# Altium project UZ_CarrierBoard.PrjPcb (part 4 of 10)

## Sheet J2-1xGTHQ_L+1xGTHCLK+GTRQ+2xGTRCLK+4xPLLCLK+CFG+STAT.SchDoc
size A4; PageSetup: Record=PageOptions|CenterHorizontal=True|CenterVertical=True|PrintScale=1.00|XCorrection=1.00|YCorrection=1.00|PrintKind=0|BorderSize=5000000|LeftOffset=0|BottomOffset=0|Orientation=2|PaperLength=1000|PaperWidth=1000|Scale=100|PaperSource=7|PrintQuality=-3|MediaType=1|DitherType=10|PrintScaleMode=1|PaperKind=A4|PaperIndex=9; Author: AG / EA / MG; CompanyName: Technische Hochschule Nürnberg Georg Simon Ohm; Address1: Kesslerplatz 12; Address2: 90489 Nürnberg; Address3: GERMANY; SheetNumber: 4; Website: www.ultrazohm.com
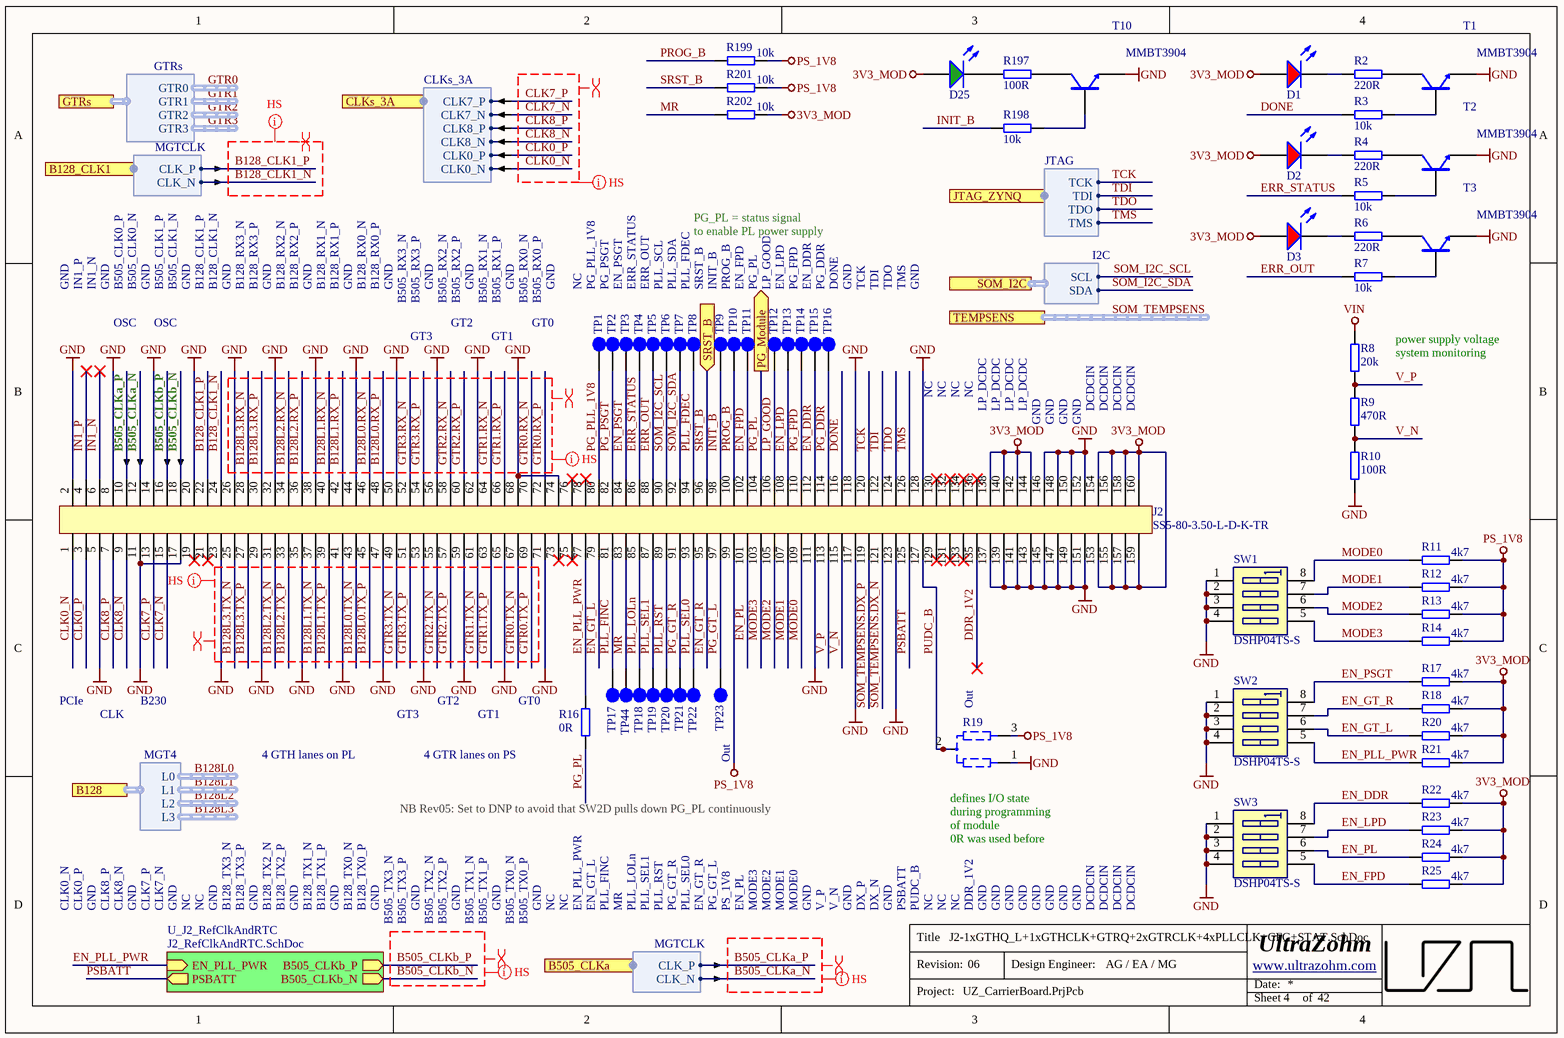
[diagram p11: J2-1xGTHQ_L+1xGTHCLK+GTRQ+2xGTRCLK+4xPLLCLK+CFG+STAT.SchDoc]

### Parts
D1  LED Red  [WL-SMCW_0603]  (value not drawn)
D2  LED Red  [WL-SMCW_0603]  (value not drawn)
D3  LED Red  [WL-SMCW_0603]  (value not drawn)
D25  LED Green  [WL-SMCW_0603]  (value not drawn)
J2  SS5-80-3.50-L-D-K-TR  [SS5-80-3.50-L-D-K-TR]
R2  220R  [R_0603_TE]
R3  10k  [R_0603_TE]
R4  220R  [R_0603_TE]
R5  10k  [R_0603_TE]
R6  220R  [R_0603_TE]
R7  10k  [R_0603_TE]
R8  20k  [R_0603_TE]
R9  470R  [R_0603_TE]
R10  100R  [R_0603_TE]
R11  4k7  [R_0603_TE]
R12  4k7  [R_0603_TE]
R13  4k7  [R_0603_TE]
R14  4k7  [R_0603_TE]
R16  0R  [R_0603_TE]
R17  4k7  [R_0603_TE]
R18  4k7  [R_0603_TE]
R19  Manual Assembly 1608 (0603)  [TP_DUAL_RES_0603]  (value not drawn)  (no BOM)
R20  4k7  [R_0603_TE]
R21  4k7  [R_0603_TE]
R22  4k7  [R_0603_TE]
R23  4k7  [R_0603_TE]
R24  4k7  [R_0603_TE]
R25  4k7  [R_0603_TE]
R197  100R  [R_0603_TE]
R198  10k  [R_0603_TE]
R199  10k  [R_0603_TE]
R201  10k  [R_0603_TE]
R202  10k  [R_0603_TE]
SW1  DSHP04TS-S  [416131160804]
SW2  DSHP04TS-S  [416131160804]
SW3  DSHP04TS-S  [416131160804]
T1  MMBT3904  [SOT95P280X145-3N]
T2  MMBT3904  [SOT95P280X145-3N]
T3  MMBT3904  [SOT95P280X145-3N]
T10  MMBT3904  [SOT95P280X145-3N]
TP1  Testpoint 1mm  [TP_1mm]  (value not drawn)  (no BOM)
TP2  Testpoint 1mm  [TP_1mm]  (value not drawn)  (no BOM)
TP3  Testpoint 1mm  [TP_1mm]  (value not drawn)  (no BOM)
TP4  Testpoint 1mm  [TP_1mm]  (value not drawn)  (no BOM)
TP5  Testpoint 1mm  [TP_1mm]  (value not drawn)  (no BOM)
TP6  Testpoint 1mm  [TP_1mm]  (value not drawn)  (no BOM)
TP7  Testpoint 1mm  [TP_1mm]  (value not drawn)  (no BOM)
TP8  Testpoint 1mm  [TP_1mm]  (value not drawn)  (no BOM)
TP9  Testpoint 1mm  [TP_1mm]  (value not drawn)  (no BOM)
TP10  Testpoint 1mm  [TP_1mm]  (value not drawn)  (no BOM)
TP11  Testpoint 1mm  [TP_1mm]  (value not drawn)  (no BOM)
TP12  Testpoint 1mm  [TP_1mm]  (value not drawn)  (no BOM)
TP13  Testpoint 1mm  [TP_1mm]  (value not drawn)  (no BOM)
TP14  Testpoint 1mm  [TP_1mm]  (value not drawn)  (no BOM)
TP15  Testpoint 1mm  [TP_1mm]  (value not drawn)  (no BOM)
TP16  Testpoint 1mm  [TP_1mm]  (value not drawn)  (no BOM)
TP17  Testpoint 1mm  [TP_1mm]  (value not drawn)  (no BOM)
TP18  Testpoint 1mm  [TP_1mm]  (value not drawn)  (no BOM)
TP19  Testpoint 1mm  [TP_1mm]  (value not drawn)  (no BOM)
TP20  Testpoint 1mm  [TP_1mm]  (value not drawn)  (no BOM)
TP21  Testpoint 1mm  [TP_1mm]  (value not drawn)  (no BOM)
TP22  Testpoint 1mm  [TP_1mm]  (value not drawn)  (no BOM)
TP23  Testpoint 1mm  [TP_1mm]  (value not drawn)  (no BOM)
TP44  Testpoint 1mm  [TP_1mm]  (value not drawn)  (no BOM)

### Sub-sheets
U_J2_RefClkAndRTC = J2_RefClkAndRTC.SchDoc: EN_PLL_PWR (in), B505_CLKb_P (out), B505_CLKb_N (out), PSBATT (out)

### Ports
B128 (harness MGT4), B128_CLK1 (harness MGTCLK), B505_CLKa (harness MGTCLK), CLKs_3A (harness CLKs_3A), GTRs (harness GTRs), JTAG_ZYNQ (harness JTAG), PG_Module (out), SOM_I2C (harness I2C), SRST_B (in), TEMPSENS (harness T_DIODE)

### Harnesses
JTAG: TDI, TCK, TMS, TDO
I2C: SCL, SDA
GTRs: GTR0, GTR1, GTR2, GTR3
MGTCLK: CLK_N, CLK_P
MGT4: L0, L1, L2, L3
CLKs_3A: CLK7_P, CLK7_N, CLK8_P, CLK8_N, CLK0_N, CLK0_P

### Nets
3V3_MOD: D1.2(A) D2.2(A) D3.2(A) D25.2(A) J2.138 J2.140 J2.142 J2.144 J2.153 J2.154 J2.155 J2.156 J2.157 J2.158 J2.159 J2.160 R17.2 R18.2 R20.2 R21.2 R22.2 R23.2 R24.2 R25.2 R202.2
GND: J2.2 J2.5 J2.8 J2.11 J2.14 J2.17 J2.20 J2.23 J2.26 J2.29 J2.32 J2.35 J2.38 J2.41 J2.44 J2.47 J2.50 J2.53 J2.56 J2.59 J2.62 J2.65 J2.68 J2.71 J2.74 J2.111 J2.117 J2.118 J2.123 J2.128 J2.137 J2.139 J2.141 J2.143 J2.145 J2.146 J2.147 J2.148 J2.149 J2.150 J2.151 J2.152 R10.1 R19.1 SW1.1 SW1.2 SW1.3 SW1.4 SW2.1 SW2.2 SW2.3 SW2.4 SW3.1 SW3.2 SW3.3 SW3.4 T1.2(EMITTER) T2.2(EMITTER) T3.2(EMITTER) T10.2(EMITTER)
PS_1V8: J2.99 R11.2 R12.2 R13.2 R14.2 R19.3 R199.2 R201.2
VIN: R8.2
B128_CLK1_N: J2.24 ; port B128_CLK1.CLK_N
B128_CLK1_P: J2.22 ; port B128_CLK1.CLK_P
B128L0.RX_N: J2.46
B128L0.RX_P: J2.48
B128L0.TX_N: J2.43
B128L0.TX_P: J2.45
B128L1.RX_N: J2.40
B128L1.RX_P: J2.42
B128L1.TX_N: J2.37
B128L1.TX_P: J2.39
B128L2.RX_N: J2.34
B128L2.RX_P: J2.36
B128L2.TX_N: J2.31
B128L2.TX_P: J2.33
B128L3.RX_N: J2.28
B128L3.RX_P: J2.30
B128L3.TX_N: J2.25
B128L3.TX_P: J2.27
B505_CLKa_N: J2.12 ; port B505_CLKa.CLK_N
B505_CLKa_P: J2.10 ; port B505_CLKa.CLK_P
B505_CLKb_N: J2.18 ; sheet U_J2_RefClkAndRTC/B505_CLKb_N
B505_CLKb_P: J2.16 ; sheet U_J2_RefClkAndRTC/B505_CLKb_P
CLK0_N: J2.1 ; port CLKs_3A.CLK0_N
CLK0_P: J2.3 ; port CLKs_3A.CLK0_P
CLK7_N: J2.15 ; port CLKs_3A.CLK7_N
CLK7_P: J2.13 ; port CLKs_3A.CLK7_P
CLK8_N: J2.9 ; port CLKs_3A.CLK8_N
CLK8_P: J2.7 ; port CLKs_3A.CLK8_P
DDR_1V2: J2.135
DONE: J2.116 R3.1
EN_DDR: J2.112 R22.1 SW3.8 TP15.1
EN_FPD: J2.102 R25.1 SW3.5 TP11.1
EN_GT_L: J2.79 R20.1 SW2.6
EN_GT_R: J2.95 R18.1 SW2.7
EN_LPD: J2.108 R23.1 SW3.7 TP13.1
EN_PL: J2.101 R24.1 SW3.6
EN_PLL_PWR: J2.77 R16.2 R21.1 SW2.5 ; sheet U_J2_RefClkAndRTC/EN_PLL_PWR
EN_PSGT: J2.84 R17.1 SW2.8 TP3.1
ERR_OUT: J2.88 R7.1 TP5.1
ERR_STATUS: J2.86 R5.1 TP4.1
GTR0.RX_N: J2.70
GTR0.RX_P: J2.72
GTR0.TX_N: J2.67
GTR0.TX_P: J2.69
GTR1.RX_N: J2.64
GTR1.RX_P: J2.66
GTR1.TX_N: J2.61
GTR1.TX_P: J2.63
GTR2.RX_N: J2.58
GTR2.RX_P: J2.60
GTR2.TX_N: J2.55
GTR2.TX_P: J2.57
GTR3.RX_N: J2.52
GTR3.RX_P: J2.54
GTR3.TX_N: J2.49
GTR3.TX_P: J2.51
IN1_N: J2.6
IN1_P: J2.4
INIT_B: J2.98 R198.1 TP9.1
LP_GOOD: J2.106 TP12.1
MODE0: J2.109 R11.1 SW1.8
MODE1: J2.107 R12.1 SW1.7
MODE2: J2.105 R13.1 SW1.6
MODE3: J2.103 R14.1 SW1.5
MR: J2.83 R202.1 TP44.1
PG_DDR: J2.114 TP16.1
PG_FPD: J2.110 TP14.1
PG_GT_L: J2.97 TP23.1
PG_GT_R: J2.91 TP21.1
PG_PL: J2.104 R16.1 ; port PG_Module  [project net PG_Module]
PG_PLL_1V8: J2.80 TP1.1
PG_PSGT: J2.82 TP2.1
PLL_FDEC: J2.94 TP8.1
PLL_FINC: J2.81 TP17.1
PLL_LOLn: J2.85 TP18.1
PLL_RST: J2.89 TP20.1
PLL_SEL0: J2.93 TP22.1
PLL_SEL1: J2.87 TP19.1
PROG_B: J2.100 R199.1 TP10.1
PSBATT: J2.125 ; sheet U_J2_RefClkAndRTC/PSBATT
PUDC_B: J2.127 R19.2
SOM_I2C_SCL: J2.90 TP6.1 ; port SOM_I2C.SCL  [project net PS_I2C1_SCL]
SOM_I2C_SDA: J2.92 TP7.1 ; port SOM_I2C.SDA  [project net PS_I2C1_SDA]
SOM_TEMPSENS.DX_N: J2.121
SOM_TEMPSENS.DX_P: J2.119
SRST_B: J2.96 R201.1 ; port SRST_B
TCK: J2.120 ; port JTAG_ZYNQ.TCK
TDI: J2.122 ; port JTAG_ZYNQ.TDI
TDO: J2.124 ; port JTAG_ZYNQ.TDO
TMS: J2.126 ; port JTAG_ZYNQ.TMS
V_N: J2.115 R9.1 R10.2
V_P: J2.113 R8.1 R9.2
NetD1_1: D1.1(K) R2.1
NetD2_1: D2.1(K) R4.1
NetD3_1: D3.1(K) R6.1
NetD25_1: D25.1(K) R197.2
NetR2_2: R2.2 T1.3(COLLECTOR)
NetR3_2: R3.2 T1.1(BASIS)
NetR4_2: R4.2 T2.3(COLLECTOR)
NetR5_2: R5.2 T2.1(BASIS)
NetR6_2: R6.2 T3.3(COLLECTOR)
NetR7_2: R7.2 T3.1(BASIS)
NetR197_1: R197.1 T10.3(COLLECTOR)
NetR198_2: R198.2 T10.1(BASIS)

Not connected (* = marked no-connect by the designer): J2 19* 21* 73* 75* 76* 78* 129* 130* 131* 132* 133* 134* 136*

### Buses and harness runs
harness SOM_TEMPSENS = port TEMPSENS

### Layout directives
differential pair: B128_CLK1_N, B128_CLK1_P, B128L0.RX_N, B128L0.RX_P, B128L0.TX_N, B128L0.TX_P, B128L1.RX_N, B128L1.RX_P, B128L1.TX_N, B128L1.TX_P, B128L2.RX_N, B128L2.RX_P, B128L2.TX_N, B128L2.TX_P, B128L3.RX_N, B128L3.RX_P, B128L3.TX_N, B128L3.TX_P, B505_CLKa_N, B505_CLKa_P, B505_CLKb_N, B505_CLKb_P, CLK0_N, CLK0_P, CLK7_N, CLK7_P, CLK8_N, CLK8_P, GTR0.RX_N, GTR0.RX_P, GTR0.TX_N, GTR0.TX_P, GTR1.RX_N, GTR1.RX_P, GTR1.TX_N, GTR1.TX_P, GTR2.RX_N, GTR2.RX_P, GTR2.TX_N, GTR2.TX_P, GTR3.RX_N, GTR3.RX_P, GTR3.TX_N, GTR3.TX_P
net class HS: B128_CLK1_N, B128_CLK1_P, B128L0.RX_N, B128L0.RX_P, B128L0.TX_N, B128L0.TX_P, B128L1.RX_N, B128L1.RX_P, B128L1.TX_N, B128L1.TX_P, B128L2.RX_N, B128L2.RX_P, B128L2.TX_N, B128L2.TX_P, B128L3.RX_N, B128L3.RX_P, B128L3.TX_N, B128L3.TX_P, B505_CLKa_N, B505_CLKa_P, B505_CLKb_N, B505_CLKb_P, CLK0_N, CLK0_P, CLK7_N, CLK7_P, CLK8_N, CLK8_P, GTR0.RX_N, GTR0.RX_P, GTR0.TX_N, GTR0.TX_P, GTR1.RX_N, GTR1.RX_P, GTR1.TX_N, GTR1.TX_P, GTR2.RX_N, GTR2.RX_P, GTR2.TX_N, GTR2.TX_P, GTR3.RX_N, GTR3.RX_P, GTR3.TX_N, GTR3.TX_P

### Notes on the sheet
- PG_PL = status signal
  to enable PL power supply
- GND
- IN1_P
- IN1_N
- B505_CLK0_P
- B505_CLK0_N
- B505_CLK1_P
- B505_CLK1_N
- B128_CLK1_P
- B128_CLK1_N
- B128_RX3_N
- B128_RX3_P
- B128_RX2_N
- B128_RX2_P
- B128_RX1_N
- B128_RX1_P
- B128_RX0_N
- B128_RX0_P
- B505_RX3_N
- B505_RX3_P
- B505_RX2_N
- B505_RX2_P
- B505_RX1_N
- B505_RX1_P
- B505_RX0_N
- B505_RX0_P
- NC
- PG_PLL_1V8
- PG_PSGT
- EN_PSGT
- ERR_STATUS
- ERR_OUT
- PLL_SCL
- PLL_SDA
- PLL_FDEC
- SRST_B
- INIT_B
- PROG_B
- EN_FPD
- PG_PL
- LP_GOOD
- EN_LPD
- PG_FPD
- EN_DDR
- PG_DDR
- DONE
- TCK
- TDI
- TDO
- TMS
- OSC
- GT3
- GT2
- GT1
- GT0
- power supply voltage system monitoring
- LP_DCDC
- DCDCIN
- PCIe
- CLK
- B230
- (near R19) Out
- 4 GTH lanes on PL
- 4 GTR lanes on PS
- Out
- NB Rev05: Set to DNP to avoid that SW2D pulls down PG_PL continuously
- (near R19) defines I/O state during programming of module
  0R was used before
- CLK0_N
- CLK0_P
- CLK8_P
- CLK8_N
- CLK7_P
- CLK7_N
- B128_TX3_N
- B128_TX3_P
- B128_TX2_N
- B128_TX2_P
- B128_TX1_N
- B128_TX1_P
- B128_TX0_N
- B128_TX0_P
- B505_TX3_N
- B505_TX3_P
- B505_TX2_N
- B505_TX2_P
- B505_TX1_N
- B505_TX1_P
- B505_TX0_N
- B505_TX0_P
- EN_PLL_PWR
- EN_GT_L
- PLL_FINC
- MR
- PLL_LOLn
- PLL_SEL1
- PLL_RST
- PG_GT_R
- PLL_SEL0
- EN_GT_R
- PG_GT_L
- PS_1V8
- EN_PL
- MODE3
- MODE2
- MODE1
- MODE0
- V_P
- V_N
- DX_P
- DX_N
- PSBATT
- PUDC_B
- DDR_1V2
- Title
- Revision:
- Design Engineer:
- Date:
- Project:
- Sheet
- of

### Library data of the parts
D1-D3 = UZgen_LED_0603_Red: Standard LEDs - SMD 0603 red; Manufacturer: UZgen; Created from: UZgenTool; Manufacturer Part Number: UZgen_LED_0603_Red; PartID: 22; Created On: 09/09/2024 10:45:01; ComponentLink1Description: N/A; ComponentLink1URL: N/A; Component Type: LED Diode; Device Package: 0603; Last Updated: 09/09/2024 10:45:01; Mounting Type: SMD; Supplier 1: LCSC; Supplier Part Number 1: =LCSC Part Number; Type: Standard; Value: LED Red; Live Cycle Status: 1; Stock number: not stored; Color: red
D25 = UZgen_LED_0603_Green: Standard LEDs - SMD 0603 green; Manufacturer: UZgen; Created from: UZgenTool; Manufacturer Part Number: UZgen_LED_0603_Green; PartID: 21; Created On: 09/09/2024 10:45:01; ComponentLink1Description: N/A; ComponentLink1URL: N/A; Component Type: LED Diode; Device Package: 0603; Last Updated: 09/09/2024 10:45:01; Mounting Type: SMD; Supplier 1: LCSC; Supplier Part Number 1: =LCSC Part Number; Type: Standard; Value: LED Green; Live Cycle Status: 1; Stock number: not stored; Color: green
J2 = SS5-80-3.50-L-D-K-TR: as J1 on sheet J1-3xGTHQ_R+B66; Manufacturer Part Number: SS5-80-3.50-L-D-K-TR; PartID: 27; Created On: 01/12/2020 18:14:32; ComponentLink1Description: Homepage; ComponentLink1URL: https://www.samtec.com/de/products/ss5-80-3.50-l-d-k-tr; Component Type: Samtec Connector; Device Package: Connector; Last Updated: 11/07/2024 09:43:54; Mounting Type: SMD; Supplier 1: SAMTEC; Supplier Part Number 1: SS5-80-3.50-L-D-K-TR; Type: Connector; Live Cycle Status: 1; Number of rows: 2; LCSC Part Number: C5292077; Stock number: not stored
R2 R4 R6 = UZgen_R_0603_220R: Generic resistor; Manufacturer: UZgen; Tolerance: 1 %; Created from: UZgenTool; Value: 220R; Manufacturer Part Number: UZgen_R_0603_220R; PartID: 205; Created On: 02/07/2024 17:29:49; Device Package: 0603; Mounting Type: SMD; Last Updated: 02/07/2024 17:29:49
R3 R5 R7 R198 R199 R201 R202 = UZgen_R_0603_10k: Generic resistor; Manufacturer: UZgen; Tolerance: 1 %; Created from: AGeiger; Value: 10k; Manufacturer Part Number: UZgen_R_0603_10k; PartID: 1; Created On: 02/07/2024 14:34:53; Device Package: 0603; Mounting Type: SMD; Last Updated: 02/07/2024 14:37:16
R8 = UZgen_R_0603_20k: Generic resistor; Manufacturer: UZgen; Tolerance: 1 %; Created from: UZgenTool; Value: 20k; Manufacturer Part Number: UZgen_R_0603_20k; PartID: 251; Created On: 02/07/2024 17:29:50; Device Package: 0603; Mounting Type: SMD; Last Updated: 02/07/2024 17:29:50
R9 = UZgen_R_0603_470R: Generic resistor; Manufacturer: UZgen; Tolerance: 1 %; Created from: UZgenTool; Value: 470R; Manufacturer Part Number: UZgen_R_0603_470R; PartID: 213; Created On: 02/07/2024 17:29:49; Device Package: 0603; Mounting Type: SMD; Last Updated: 02/07/2024 17:29:49
R10 R197 = UZgen_R_0603_100R: Generic resistor; Manufacturer: UZgen; Tolerance: 1 %; Created from: UZgenTool; Value: 100R; Manufacturer Part Number: UZgen_R_0603_100R; PartID: 197; Created On: 02/07/2024 17:29:48; Device Package: 0603; Mounting Type: SMD; Last Updated: 02/07/2024 17:29:48
R11-R14 R17 R18 R20-R25 = UZgen_R_0603_4k7: Generic resistor; Manufacturer: UZgen; Tolerance: 1 %; Created from: UZgenTool; Value: 4k7; Manufacturer Part Number: UZgen_R_0603_4k7; PartID: 237; Created On: 02/07/2024 17:29:50; Device Package: 0603; Mounting Type: SMD; Last Updated: 02/07/2024 17:29:50
R16 = UZgen_R_0603_0R: Generic resistor; Manufacturer: UZgen; Tolerance: 1 %; Created from: UZgenTool; Value: 0R; Manufacturer Part Number: UZgen_R_0603_0R; PartID: 581; Created On: 08/07/2024 14:34:30; Device Package: 0603; Mounting Type: SMD; Last Updated: 08/07/2024 14:34:30
R19 = 30792: Manual Assembly Resistors Placeholder 1608 (0603) Dual; AN: 30792; Mixed: MECH
SW1-SW3 = DSHP04TS-S: 04p, 1.27mm Pitch, Horizontal, HP Type, SMT, flat Actuator, black, with Tape, T&R; Manufacturer: XKB Connectivity; Value: DIP-Switch; Created from: T. Wendt; Manufacturer Part Number: DSHP04TS-S; PartID: 6; Created On: 02/03/2021 14:59:37; ComponentLink1Description: Datasheet; ComponentLink1URL: https://datasheet.lcsc.com/szlcsc/1912111437_XKB-Connectivity-DSHP04TS-S_C319050.pdf; Component Type: DIP-Switch; Device Package: DIP; Last Updated: 08/10/2021 08:00:32; Minimum Order: 1; Mounting Type: SMD; Supplier 1: LCSC; Supplier Part Number 1: C319050; Type: DIP-Switch; Live Cycle Status: 1; LCSC Part Number: C319050; Stock number: not stored
T1-T3 T10 = MMBT3904: Bipolartransistor, 40V 200mW 200mA 100@10mA,1V 300MHz 300mV@50mA,5mA NPN +150℃@(Tj) SOT-23(SOT-23-3); Manufacturer: Jiangsu Changjing Electronics Technology Co., Ltd.; Number Of Channels: single; Collector Basis Voltage: 60 V; Created from: NDiringer; Manufacturer Part Number: MMBT3904; PartID: 2; Created On: 10/06/2022 12:04:49; ComponentLink1Description: Datasheet; ComponentLink1URL: https://datasheet.lcsc.com/lcsc/1811011934_Jiangsu-Changjing-Electronics-Technology-Co---Ltd--MMBT3904_C20526.pdf; Component Type: Bipolartransistor; Device Package: SOT-23-3; Last Updated: 10/08/2022 13:48:16; Mounting Type: SMD; Operating Temperature: -55 - 150 °C; Series: MMBT3904; Supplier 1: Mouser; Supplier Part Number 1: MMBT3904; Supplier 2: LCSC/JLCPCB; Supplier Part Number 2: C20526; Type: Bipolartransistor; Collector Emitter Voltage: 40 V; Polarization: NPN; Power Dissipation: 200 mW; Value: 40 V; Live Cycle Status: 1; LCSC Part Number: C20526
TP1-TP23 TP44 = 25063: AN: 25063; Mixed: SMT

## Sheet J2_RefClkAndRTC.SchDoc
size A4; Organization: UltraZohm; SheetNumber: 5
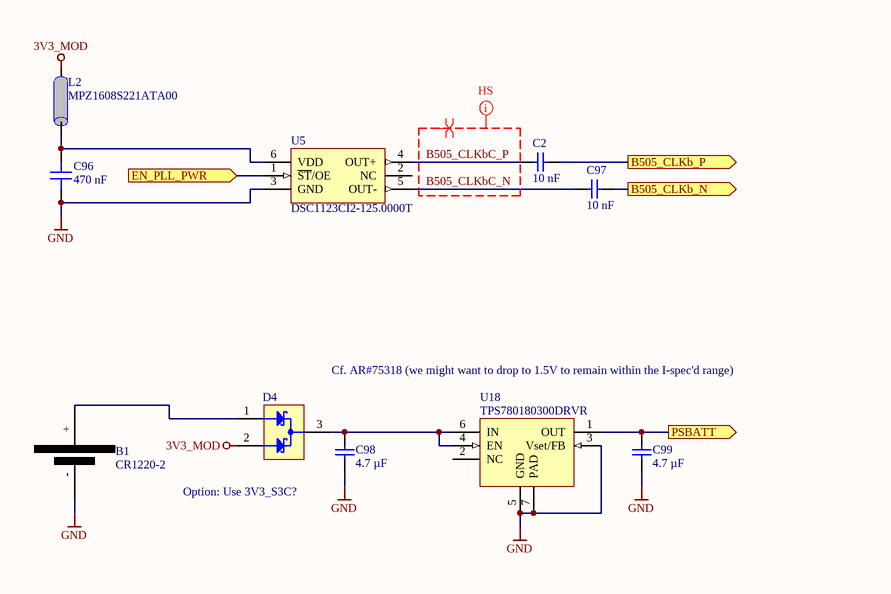
[diagram p12: J2_RefClkAndRTC.SchDoc]

### Parts
B1  CR1220-2  [CR1220]
C2  10 nF  [C_0402_TE]
C96  470 nF  [C_0603_TE]
C97  10 nF  [C_0402_TE]
C98  4.7 µF  [C_0603_TE]
C99  4.7 µF  [C_0603_TE]
D4  BAT54CT-7-F  [SOT523-3]  (value not drawn)
L2  MPZ1608S221ATA00  [RES 0603_1608]
U5  DSC1123CI2-125.0000T  [PSON105P320X250X90-6N]
U18  TPS780180300DRVR  [SON65P200X200X80-7N]

### Ports
B505_CLKb_N (out), B505_CLKb_P (out), EN_PLL_PWR (in), PSBATT (out)

### Nets
3V3_MOD: D4.2(A) L2.1
GND: B1.- C96.1 C98.1 C99.1 U5.3(GND) U18.3(Vset/FB) U18.5(GND) U18.7(PAD)
B505_CLKb_N: C97.2 ; port B505_CLKb_N
B505_CLKb_P: C2.2 ; port B505_CLKb_P
B505_CLKbC_N: C97.1 U5.5(OUT-)
B505_CLKbC_P: C2.1 U5.4(OUT+)
EN_PLL_PWR: U5.1(~{ST}/OE) ; port EN_PLL_PWR
PSBATT: C99.2 U18.1(OUT) ; port PSBATT
NetB1_+: B1.+ D4.1(A)
NetC96_2: C96.2 L2.2 U5.6(VDD)
NetC98_2: C98.2 D4.3(K) U18.4(EN) U18.6(IN)

Not connected (* = marked no-connect by the designer): U5 2(NC); U18 2(NC)

### Layout directives
differential pair: B505_CLKbC_N, B505_CLKbC_P
net class HS: B505_CLKbC_N, B505_CLKbC_P

### Notes on the sheet
- Cf. AR#75318 (we might want to drop to 1.5V to remain within the I-spec'd range)
- Option: Use 3V3_S3C?
- Title
- Revision:
- Design Engineer:
- Date:
- Project:
- Sheet
- of

### Library data of the parts
B1 = CR1220-2: Battery base CR1220 SMD Button And Strip Battery Connector ROHS; Manufacturer: Q&J; Created from: FRosner; Manufacturer Part Number: CR1220-2; PartID: 36; Created On: 02/07/2024 19:17:25; ComponentLink1Description: Datasheet; ComponentLink1URL: https://wmsc.lcsc.com/wmsc/upload/file/pdf/v2/lcsc/2405081637_Q-J-CR1220-2_C70381.pdf; Component Type: Battery holder; Device Package: SMD; Last Updated: 23/08/2024 11:42:29; Mounting Type: SMD; Operating Temperature: -40 to +85 °C; Supplier 1: LCSC; Supplier Part Number 1: C70381; Type: Battery holder; Live Cycle Status: 1; LCSC Part Number: C70381; Stock number: not stored
C2 C97 = UZgen_C_0402_10nF_16V_X7R: as C100 on sheet GTH; Technology: X7R; Value: 10 nF; Manufacturer Part Number: UZgen_C_0402_10nF_16V_X7R; PartID: 2900; Created On: 02/08/2024 11:17:39; Device Package: 0402; Mounting Type: SMD; Last Updated: 02/08/2024 11:17:39
C96 = CL10A474KB8NNNC: Capacitor 0603, 50 VDC, 470 nF, X5R; Manufacturer: Samsung Electro-Mechanics; Tolerance: 10 %; Voltage Rating: 50 VDC; Created from: AGeiger; Value: 470 nF; Manufacturer Part Number: CL10A474KB8NNNC; PartID: 103; Created On: 22/08/2022 14:44:45; ComponentLink1Description: Datasheet; ComponentLink1URL: https://datasheet.lcsc.com/lcsc/1810191213_Samsung-Electro-Mechanics-CL10A474KB8NNNC_C170149.pdf; Component Type: Capacitor 0603; Device Package: 0603; Last Updated: 22/04/2025 15:48:45; Mounting Type: SMD; Operating Temperature: -55 - 85°C; Series: X5R; Supplier 1: LCSC; Supplier Part Number 1: C170149; Supplier 2: Mouser; Supplier Part Number 2: 187-CL10A474KB8NNNC; Type: Capacitor; Live Cycle Status: 1; LCSC Part Number: C170149
C98 C99 = UZgen_C_0603_4.7uF_16V_X5R: Generic capacitor; Manufacturer: UZgen; Voltage: 16V; Tolerance: 10 %; Created from: MGeier; Manufacturer Part Number: UZgen_C_0603_4.7uF_16V_X5R; PartID: 5809; Created On: 20/03/2025 14:43:45; Value: 4.7 µF; Device Package: 0603; Technology: X5R; Mounting Type: SMD; Last Updated: 20/03/2025 14:43:45
D4 = BAT54CT-7-F: Surface-mount Schottky Barrier Diode, 1 Pair Common Cathode 1V@100mA 200mA 2uA@25V 30V SOT-523-3; Manufacturer: Diodes Incorporated; Type: Schottky Diode; Forward Current: 1 mA; Forward Voltage: 320 mV; Reverse Current: 2 µA; Created from: MGeier; Manufacturer Part Number: BAT54CT-7-F; PartID: 28; Created On: 19/07/2025 15:30:00; ComponentLink1Description: Datasheet; ComponentLink1URL: https://www.diodes.com/datasheet/download/BAT54T.pdf; Component Type: Schottky Diode; Device Package: SOT-523-3; Last Updated: 21/07/2025 13:11:15; Mounting Type: SMD; Operating Temperature: -65 to +150 °C; Series: BAT54T/AT/CT/ST; Supplier 1: LCSC; Supplier Part Number 1: C134407; Value: 30 V; Live Cycle Status: 1; LCSC Part Number: C134407; Stock number: not stored; ComponentLink2Description: Homepage; ComponentLink2URL: https://www.diodes.com/part/view/BAT54CT
L2 = MPZ1608S221ATA00: Ferritperle, 0603, 220 ohm, 2.2 A, Baureihe MPZ, 0.05 ohm, ± 25%; Manufacturer: TDK; Value: 220 Ohm; Type: Ferrite; DC current: 2.2 A; Created from: MGremer; Manufacturer Part Number: MPZ1608S221ATA00; PartID: 3; Created On: 08/06/2021 11:33:39; ComponentLink1Description: Datasheet; ComponentLink1URL: http://www.farnell.com/datasheets/2291439.pdf; Component Type: Ferritperle; Device Package: 0603; Last Updated: 12/07/2024 17:26:54; Mounting Type: SMD; Operating Temperature: -55 - 125 °C; Series: MPZ; Supplier 1: Farnell; Supplier Part Number 1: 1301677RL; Live Cycle Status: 1; LCSC Part Number: C76815; Stock number: not stored
U5 = DSC1123CI2-125.0000T: Standard Clock Oscillators MEMS OSC, LVDS, 125MHz, 25PPM, 2.5-3.3V, -40 to 85C, 3.2 x 2.5mm; Manufacturer: Microchip; Created from: FRosner; Manufacturer Part Number: DSC1123CI2-125.0000T; PartID: 8; Created On: 30/07/2024 09:44:11; ComponentLink1Description: Datasheet; ComponentLink1URL: https://www.mouser.de/datasheet/2/268/DSC1103_23_Low_Jitter_Precision_LVDS_Oscillator_DS-3314614.pdf; Component Type: LVDS; Device Package: VDFN-6; Last Updated: 30/07/2024 09:44:11; Mounting Type: SMD; Operating Temperature: -40°C - 85°C; Series: DSC1123; Supplier 1: Mouser; Supplier Part Number 1: 998-1123CI2125.0000T; Supplier 2: LCSC; Supplier Part Number 2: C1987227; Value: DSC1123CI2-125.0000T; LCSC Part Number: C1987227
U18 = TPS780180300DRVR: LDO Voltage Regulators 150mA,LDO Reg,Ultra Low Pwr; Manufacturer: Texas Instruments; Value: 1.8 V, 3 V; Created from: FRosner; Manufacturer Part Number: TPS780180300DRVR; PartID: 17; Created On: 02/07/2024 16:16:00; ComponentLink1Description: Datasheet; ComponentLink1URL: https://wmsc.lcsc.com/wmsc/upload/file/pdf/v2/lcsc/2302220830_Texas-Instruments-TPS780180300DRVR_C2860011.pdf; Component Type: LDO; Device Package: SMD; Last Updated: 03/09/2024 16:21:15; Mounting Type: SMD; Operating Temperature: -40 to +125 °C; Series: TPS780; Supplier 1: Mouser; Supplier Part Number 1: 595-TPS780180300DRVR; Supplier 2: LCSC; Supplier Part Number 2: C2860011; Type: LDO; Live Cycle Status: 1; LCSC Part Number: C2860011; Stock number: not stored